# EAGLE design S284B (EAGLE 6.6.0)
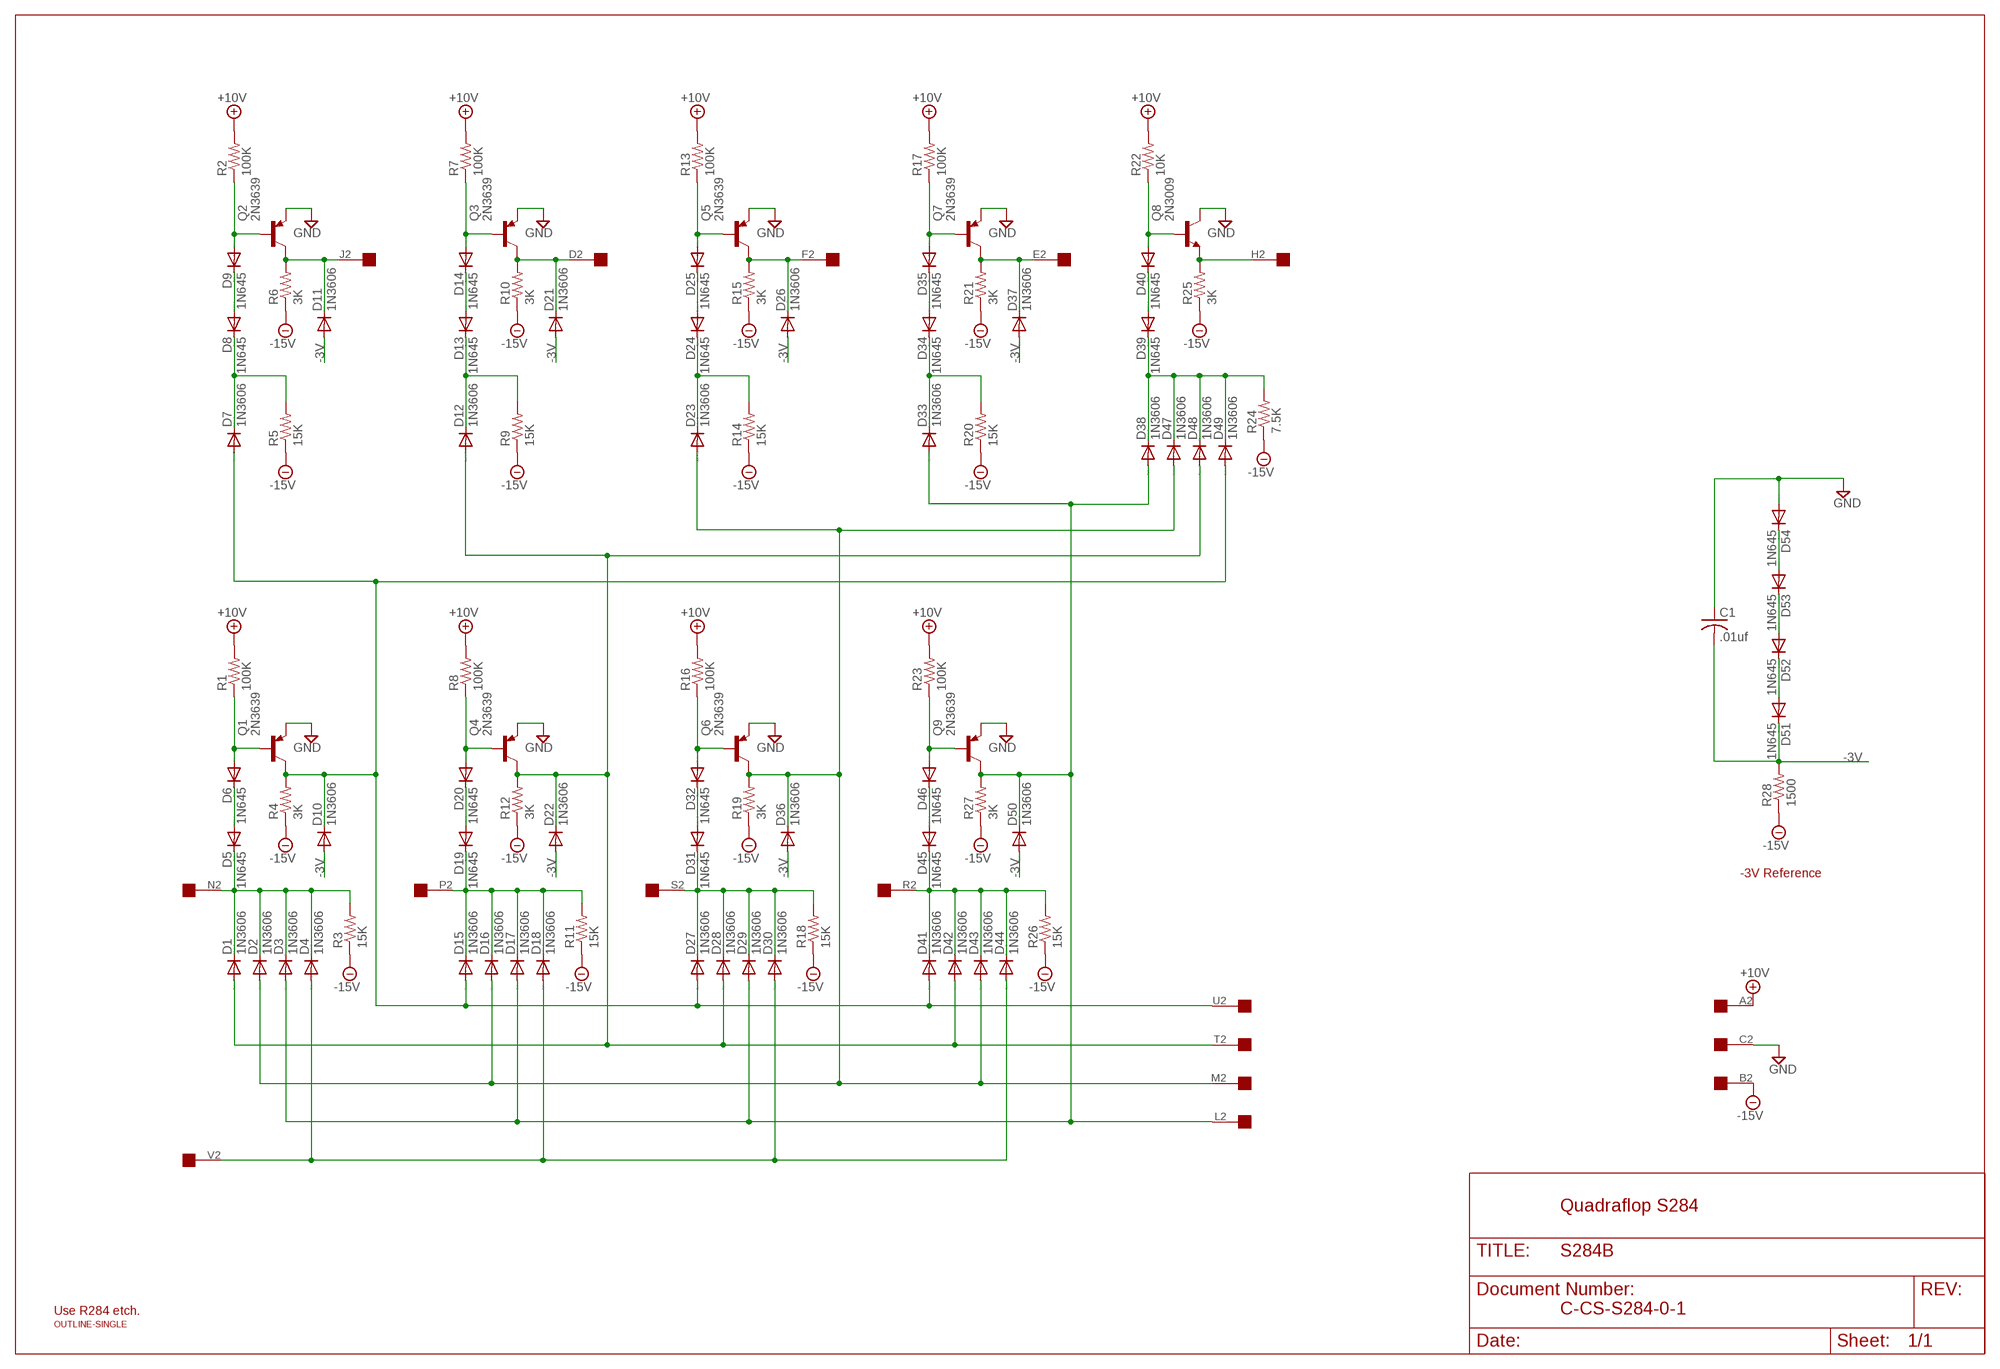
[diagram p0: schematic, sheet 1]

## Parts
C1  .01uf  C-US050-025X075  [C050-025X075]
D1  1N3606  1N4148DO35-10  [DO35-10]
D2  1N3606  1N4148DO35-10  [DO35-10]
D3  1N3606  1N4148DO35-10  [DO35-10]
D4  1N3606  1N4148DO35-10  [DO35-10]
D5  1N645  1N4148DO35-10  [DO35-10]
D6  1N645  1N4148DO35-10  [DO35-10]
D7  1N3606  1N4148DO35-10  [DO35-10]
D8  1N645  1N4148DO35-10  [DO35-10]
D9  1N645  1N4148DO35-10  [DO35-10]
D10  1N3606  1N4148DO35-10  [DO35-10]
D11  1N3606  1N4148DO35-10  [DO35-10]
D12  1N3606  1N4148DO35-10  [DO35-10]
D13  1N645  1N4148DO35-10  [DO35-10]
D14  1N645  1N4148DO35-10  [DO35-10]
D15  1N3606  1N4148DO35-10  [DO35-10]
D16  1N3606  1N4148DO35-10  [DO35-10]
D17  1N3606  1N4148DO35-10  [DO35-10]
D18  1N3606  1N4148DO35-10  [DO35-10]
D19  1N645  1N4148DO35-10  [DO35-10]
D20  1N645  1N4148DO35-10  [DO35-10]
D21  1N3606  1N4148DO35-10  [DO35-10]
D22  1N3606  1N4148DO35-10  [DO35-10]
D23  1N3606  1N4148DO35-10  [DO35-10]
D24  1N645  1N4148DO35-10  [DO35-10]
D25  1N645  1N4148DO35-10  [DO35-10]
D26  1N3606  1N4148DO35-10  [DO35-10]
D27  1N3606  1N4148DO35-10  [DO35-10]
D28  1N3606  1N4148DO35-10  [DO35-10]
D29  1N3606  1N4148DO35-10  [DO35-10]
D30  1N3606  1N4148DO35-10  [DO35-10]
D31  1N645  1N4148DO35-10  [DO35-10]
D32  1N645  1N4148DO35-10  [DO35-10]
D33  1N3606  1N4148DO35-10  [DO35-10]
D34  1N645  1N4148DO35-10  [DO35-10]
D35  1N645  1N4148DO35-10  [DO35-10]
D36  1N3606  1N4148DO35-10  [DO35-10]
D37  1N3606  1N4148DO35-10  [DO35-10]
D38  1N3606  1N4148DO35-10  [DO35-10]
D39  1N645  1N4148DO35-10  [DO35-10]
D40  1N645  1N4148DO35-10  [DO35-10]
D41  1N3606  1N4148DO35-10  [DO35-10]
D42  1N3606  1N4148DO35-10  [DO35-10]
D43  1N3606  1N4148DO35-10  [DO35-10]
D44  1N3606  1N4148DO35-10  [DO35-10]
D45  1N645  1N4148DO35-10  [DO35-10]
D46  1N645  1N4148DO35-10  [DO35-10]
D47  1N3606  1N4148DO35-10  [DO35-10]
D48  1N3606  1N4148DO35-10  [DO35-10]
D49  1N3606  1N4148DO35-10  [DO35-10]
D50  1N3606  1N4148DO35-10  [DO35-10]
D51  1N645  1N4148DO35-10  [DO35-10]
D52  1N645  1N4148DO35-10  [DO35-10]
D53  1N645  1N4148DO35-10  [DO35-10]
D54  1N645  1N4148DO35-10  [DO35-10]
Q1  2N3639  2N3637  [TO39]
Q2  2N3639  2N3637  [TO39]
Q3  2N3639  2N3637  [TO39]
Q4  2N3639  2N3637  [TO39]
Q5  2N3639  2N3637  [TO39]
Q6  2N3639  2N3637  [TO39]
Q7  2N3639  2N3637  [TO39]
Q8  2N3009  2N2102  [TO5]
Q9  2N3639  2N3637  [TO39]
R1  100K  R-US_0207/10  [0207/10]
R2  100K  R-US_0207/10  [0207/10]
R3  15K  R-US_0207/10  [0207/10]
R4  3K  R-US_0207/10  [0207/10]
R5  15K  R-US_0207/10  [0207/10]
R6  3K  R-US_0207/10  [0207/10]
R7  100K  R-US_0207/10  [0207/10]
R8  100K  R-US_0207/10  [0207/10]
R9  15K  R-US_0207/10  [0207/10]
R10  3K  R-US_0207/10  [0207/10]
R11  15K  R-US_0207/10  [0207/10]
R12  3K  R-US_0207/10  [0207/10]
R13  100K  R-US_0207/10  [0207/10]
R14  15K  R-US_0207/10  [0207/10]
R15  3K  R-US_0207/10  [0207/10]
R16  100K  R-US_0207/10  [0207/10]
R17  100K  R-US_0207/10  [0207/10]
R18  15K  R-US_0207/10  [0207/10]
R19  3K  R-US_0207/10  [0207/10]
R20  15K  R-US_0207/10  [0207/10]
R21  3K  R-US_0207/10  [0207/10]
R22  10K  R-US_0207/10  [0207/10]
R23  100K  R-US_0207/10  [0207/10]
R24  7.5K  R-US_0207/10  [0207/10]
R25  3K  R-US_0207/10  [0207/10]
R26  15K  R-US_0207/10  [0207/10]
R27  3K  R-US_0207/10  [0207/10]
R28  1500  R-US_0207/10  [0207/10]
U$1  OUTLINE-SINGLE  [SINGLE]
U$2  EDGE-1  [EDGE-CON1]

## Nets
+10V [Power]: R1.2 R2.2 R7.2 R8.2 R13.2 R16.2 R17.2 R22.2 R23.2 U$2.A2
-0.8V [Power]: D53.A D54.C
-3V [Power]: C1.2 D10.A D11.A D21.A D22.A D26.A D36.A D37.A D50.A D51.C R28.2
-15V [Power]: R3.1 R4.1 R5.1 R6.1 R9.1 R10.1 R11.1 R12.1 R14.1 R15.1 R18.1 R19.1 R20.1 R21.1 R24.1 R25.1 R26.1 R27.1 R28.1 U$2.B2
GND [Power]: C1.1 D54.A Q1.1(E) Q2.1(E) Q3.1(E) Q4.1(E) Q5.1(E) Q6.1(E) Q7.1(E) Q8.3(C) Q9.1(E) U$2.C2
L: D3.A D17.A D29.A D33.A D38.A D50.C Q9.3(C) R27.2 U$2.L2
M: D2.A D16.A D23.A D36.C D43.A D47.A Q6.3(C) R19.2 U$2.M2
N: D1.C D2.C D3.C D4.C D5.C R3.2 U$2.N2
N$2: D20.A Q4.2(B) R8.1
N$3: D19.A D20.C
N$4: D7.A D10.C D15.A D27.A D41.A D49.A Q1.3(C) R4.2 U$2.U2
N$5: D7.C D8.C R5.2
N$6: D1.A D12.A D22.C D28.A D42.A D48.A Q4.3(C) R12.2 U$2.T2
N$7: D12.C D13.C R9.2
N$8: D13.A D14.C
N$9: D8.A D9.C
N$12: D21.C Q3.3(C) R10.2 U$2.D2
N$13: D52.A D53.C
N$14: D11.C Q2.3(C) R6.2 U$2.J2
N$15: D14.A Q3.2(B) R7.1
N$16: D51.A D52.C
N$17: D27.C D28.C D29.C D30.C D31.C R18.2 U$2.S2
N$19: D32.A Q6.2(B) R16.1
N$20: D4.A D18.A D30.A D44.A U$2.V2
N$21: D31.A D32.C
N$22: D9.A Q2.2(B) R2.1
N$23: D38.C D39.C D47.C D48.C D49.C R24.2
N$24: D23.C D24.C R14.2
N$25: D24.A D25.C
N$26: D26.C Q5.3(C) R15.2 U$2.F2
N$28: D25.A Q5.2(B) R13.1
N$29: D41.C D42.C D43.C D44.C D45.C R26.2 U$2.R2
N$30: D6.A Q1.2(B) R1.1
N$31: D46.A Q9.2(B) R23.1
N$32: D5.A D6.C
N$33: D45.A D46.C
N$34: D40.A Q8.2(B) R22.1
N$35: D33.C D34.C R20.2
N$36: D34.A D35.C
N$37: D37.C Q7.3(C) R21.2 U$2.E2
N$38: D35.A Q7.2(B) R17.1
N$39: D39.A D40.C
N$40: Q8.1(E) R25.2 U$2.H2
P: D15.C D16.C D17.C D18.C D19.C R11.2 U$2.P2
Unconnected: U$2.K2

## Notes on the sheet
- -3V Reference
- Quadraflop S284
- Use R284 etch. | C-CS-S284-0-1

## Library data of the parts
C1 = rcl:C-US: CAPACITOR, American symbol
D1-D54 = diode:1N4148: DIODE high speed (Philips)
Q1-Q7 Q9 = transistor-pnp:2N3637*: PNP Transistror
Q8 = transistor:2N2102: NPN TRANSISTOR
R1-R28 = rcl:R-US_: RESISTOR, American symbol
U$1 = dec-con:OUTLINE-*: Board outlines for DEC boards.
U$2 = dec-con:EDGE-1: Single-Sided DEC Edge Connector -- (side 2)

## Net classes
1 Power: width 0.813 mm

## Board
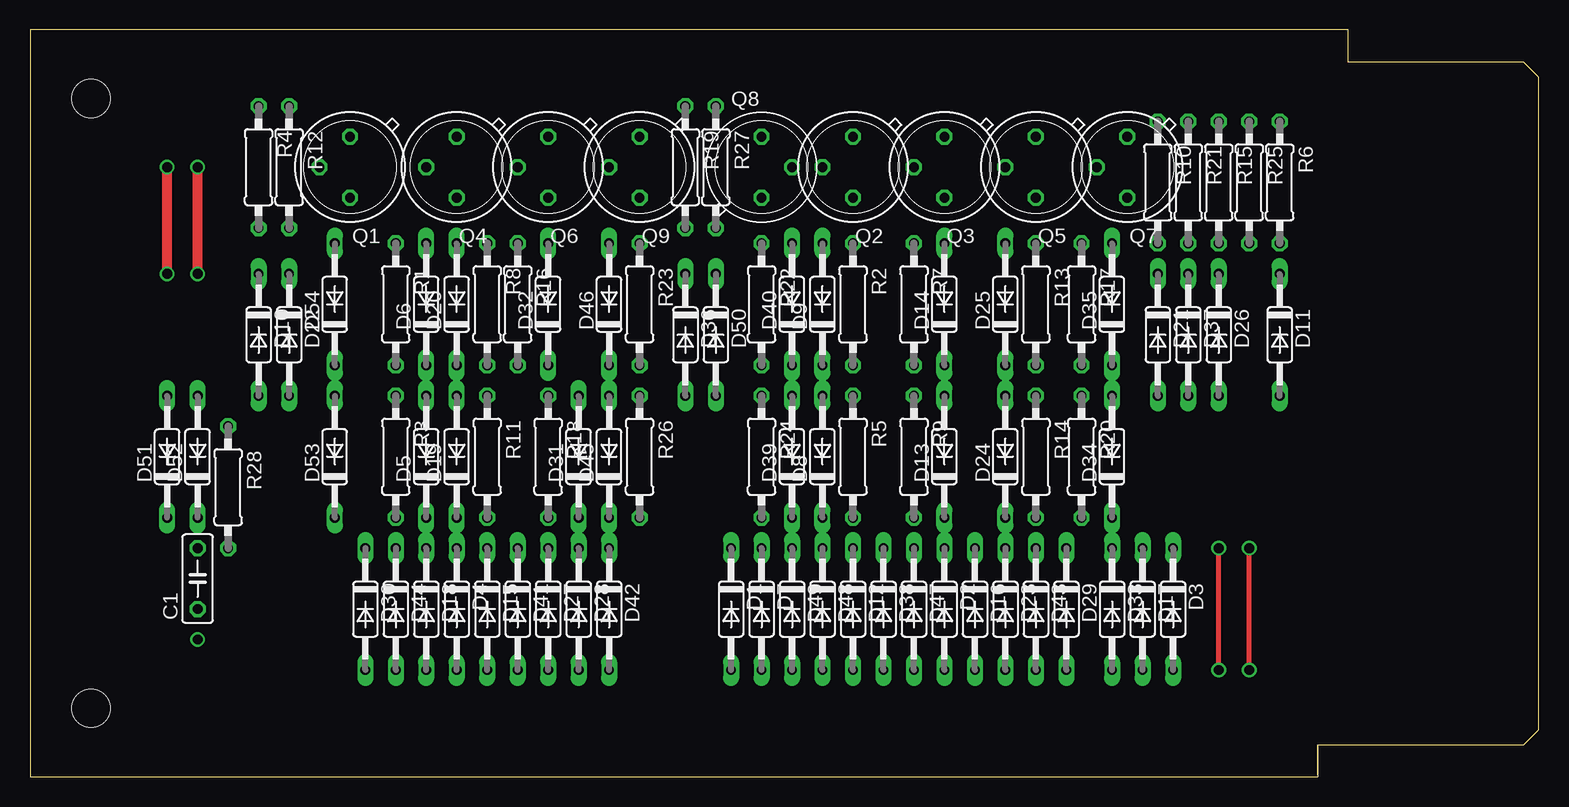
[diagram p1: board, top side]
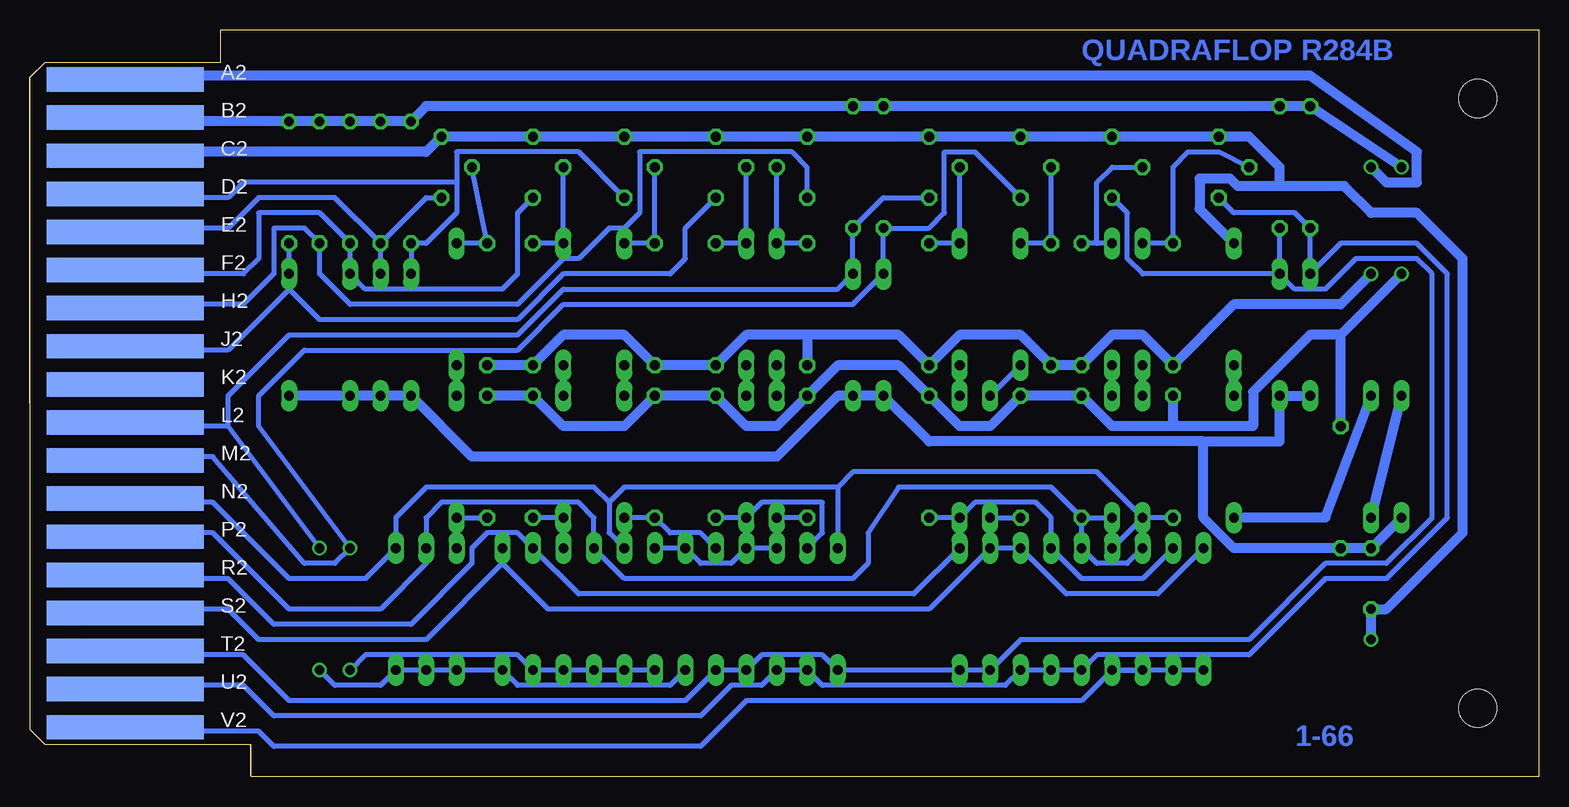
[diagram p2: board, bottom side, seen from below]

Size 125.73 x 62.23 mm. Coordinates in mm from the lower left corner, seen from the top.
Copper layers (1+16): Top 0.035mm / dielectric 1.5mm / Bottom 0.035mm
Design rules "16mils": minimum track width 16mil, minimum drill 32mil, track to track 15mil, track to pad 10mil, pad to pad 10mil, via to via 10mil, smd to smd 10mil, copper to edge 13mil, drill to drill 10mil, minimum pad ring 10mil, minimum via ring 8mil, stop-mask expansion 0mil, vias tented up to drill 0mil, thermal gap 10mil

### Footprints (pad centres in the part's own frame; a part is rotated, then mirrored left to right if it is on the bottom)
C050-025X075 = drill 0.813 octagon: 1 -2.54,0; 2 2.54,0
DO35-10 = drill 0.813 long: A 5.08,0; C -5.08,0
TO39 = drill 0.813 octagon: 1 0,-2.54; 2 2.54,0; 3 0,2.54
TO5 = drill 0.813 octagon: 1 0,-2.54; 2 2.54,0; 3 0,2.54
0207/10 = drill 0.813 octagon: 1 -5.08,0; 2 5.08,0
SINGLE = hole 3.175: 120.65,56.515; 120.65,5.715
EDGE-CON1 = smd 13.106 x 2.032 bottom: A2 7.938,4.128; B2 7.938,7.303; C2 7.938,10.477; D2 7.938,13.652; E2 7.938,16.828; F2 7.938,20.003; H2 7.938,23.177; J2 7.938,26.352; K2 7.938,29.527; L2 7.938,32.703; M2 7.938,35.877; N2 7.938,39.053; P2 7.938,42.227; R2 7.938,45.403; S2 7.938,48.578; T2 7.938,51.752; U2 7.938,54.928; V2 7.938,58.102

### Placement (x,y rotation side)
C1  13.97,16.51 90 top
D1  58.42,13.97 270 top
D2  76.2,13.97 270 top
D3  95.25,13.97 270 top
D4  35.56,13.97 270 top
D5  33.02,26.67 90 top
D6  33.02,39.37 90 top
D7  60.96,13.97 270 top
D8  66.04,26.67 90 top
D9  66.04,39.37 90 top
D10  19.05,36.83 270 top
D11  104.14,36.83 270 top
D12  68.58,13.97 270 top
D13  76.2,26.67 90 top
D14  76.2,39.37 90 top
D15  38.1,13.97 270 top
D16  78.74,13.97 270 top
D17  92.71,13.97 270 top
D18  33.02,13.97 270 top
D19  35.56,26.67 90 top
D20  35.56,39.37 90 top
D21  93.98,36.83 270 top
D22  21.59,36.83 270 top
D23  81.28,13.97 270 top
D24  81.28,26.67 90 top
D25  81.28,39.37 90 top
D26  99.06,36.83 270 top
D27  43.18,13.97 270 top
D28  45.72,13.97 270 top
D29  86.36,13.97 270 top
D30  27.94,13.97 270 top
D31  45.72,26.67 90 top
D32  43.18,39.37 90 top
D33  90.17,13.97 270 top
D34  90.17,26.67 90 top
D35  90.17,39.37 90 top
D36  54.61,36.83 270 top
D37  96.52,36.83 270 top
D38  71.12,13.97 270 top
D39  63.5,26.67 90 top
D40  63.5,39.37 90 top
D41  40.64,13.97 270 top
D42  48.26,13.97 270 top
D43  83.82,13.97 270 top
D44  30.48,13.97 270 top
D45  48.26,26.67 90 top
D46  48.26,39.37 90 top
D47  73.66,13.97 270 top
D48  66.04,13.97 270 top
D49  63.5,13.97 270 top
D50  57.15,36.83 270 top
D51  11.43,26.67 90 top
D52  13.97,26.67 90 top
D53  25.4,26.67 90 top
D54  25.4,39.37 90 top
Q1  26.67,50.8 180 top
Q2  68.58,50.8 180 top
Q3  76.2,50.8 180 top
Q4  35.56,50.8 180 top
Q5  83.82,50.8 180 top
Q6  43.18,50.8 180 top
Q7  91.44,50.8 180 top
Q8  60.96,50.8 0 top
Q9  50.8,50.8 180 top
R1  30.48,39.37 270 top
R2  68.58,39.37 270 top
R3  30.48,26.67 270 top
R4  19.05,50.8 270 top
R5  68.58,26.67 270 top
R6  104.14,49.53 270 top
R7  73.66,39.37 270 top
R8  38.1,39.37 270 top
R9  73.66,26.67 270 top
R10  93.98,49.53 270 top
R11  38.1,26.67 270 top
R12  21.59,50.8 270 top
R13  83.82,39.37 270 top
R14  83.82,26.67 270 top
R15  99.06,49.53 270 top
R16  40.64,39.37 270 top
R17  87.63,39.37 270 top
R18  43.18,26.67 270 top
R19  54.61,50.8 270 top
R20  87.63,26.67 270 top
R21  96.52,49.53 270 top
R22  60.96,39.37 270 top
R23  50.8,39.37 270 top
R24  60.96,26.67 270 top
R25  101.6,49.53 270 top
R26  50.8,26.67 270 top
R27  57.15,50.8 270 top
R28  16.51,24.13 270 top
U$1  125.73,62.23 180 top
U$2  125.73,62.23 180 top

### Tracks (layer width: path | path; a pad name or v marks a point on that pad's centre or on a via)
+10V  (via drill 0.81)
  Top 0.813: v13.97,41.91 v13.97,50.8
  Bottom 0.813: R17.2 R13.2 81.28,36.83 76.2,36.83 R7.2 R2.2 66.04,36.83 60.96,36.83 | U$2.A2 117.22,58.04 116.84,58.42 19.05,58.42 10.16,52.07 10.16,49.53 12.7,49.53 v13.97,50.8 | 60.96,36.83 R22.2 | 60.96,36.83 53.34,36.83 R23.2 48.26,36.83 43.18,36.83 R16.2 R8.2 35.56,36.83 33.02,36.83 R1.2 25.4,39.37 16.51,39.37 v13.97,41.91
-0.8V
  Bottom 0.813: D53.A D54.C
-3V
  Bottom 0.813: 27.94,27.94 21.59,27.94 D22.A D10.A | 27.94,27.94 50.8,27.94 D36.A D50.A 58.42,31.75 63.5,26.67 88.9,26.67 D21.A D37.A D26.A D11.A | D51.C C1.2 R28.2 25.4,19.05 27.94,21.59 27.94,27.94
-15V  (via drill 0.81)
  Top 0.813: v11.43,41.91 v11.43,50.8
  Bottom 0.813: U$2.B2 117.13,54.9 116.84,54.61 R6.1 R25.1 R15.1 R21.1 R10.1 92.71,55.88 R27.1 R19.1 R12.1 R4.1 v11.43,50.8 | R20.1 R14.1 81.28,29.21 76.2,29.21 R9.1 R5.1 66.04,29.21 63.5,29.21 R24.1 58.42,34.29 53.34,34.29 R26.1 48.26,29.21 45.72,29.21 R18.1 R11.1 35.56,29.21 30.48,29.21 | 30.48,29.21 R3.1 | 30.48,29.21 23.81,29.21 23.81,32.07 19.05,36.83 16.51,36.83 | 16.51,36.83 v11.43,41.91 | R28.1 16.51,36.83
GND  (via drill 0.81)
  Bottom 0.813: U$2.C2 117.17,51.74 116.84,52.07 92.71,52.07 Q7.1 Q5.1 Q3.1 Q2.1 Q8.3 Q9.1 Q6.1 Q4.1 Q1.1 24.13,53.34 21.59,50.8 21.59,49.21 | D54.A 28.26,47.31 28.26,49.85 25.72,49.85 25.08,49.21 21.59,49.21 | 21.59,49.21 16.19,49.21 13.97,46.99 10.16,46.99 6.35,43.18 6.35,20.32 12.7,13.97 C1.1 v13.97,11.43
L  (via drill 0.81)
  Top 0.406: v101.6,8.89 v101.6,19.05
  Bottom 0.406: v101.6,8.89 100.33,7.62 96.52,7.62 D3.A D17.A D33.A D29.A 85.09,7.62 72.39,7.62 D38.A | U$2.L2 117.17,29.54 116.84,29.21 109.22,29.21 | v101.6,19.05 109.22,29.21 | 109.22,29.21 109.22,31.75 104.14,36.83 85.09,36.83 81.28,40.64 58.42,40.64 D50.C R27.2 54.61,48.26 Q9.3
M  (via drill 0.81)
  Top 0.406: v99.06,8.89 v99.06,19.05
  Bottom 0.406: U$2.M2 117.17,26.34 116.84,26.67 110.49,26.67 102.87,17.78 100.33,17.78 v99.06,19.05 106.68,29.21 106.68,31.75 102.87,35.56 85.09,35.56 81.28,39.37 57.15,39.37 D36.C R19.2 50.8,45.72 49.53,46.99 49.53,52.07 46.99,52.07 Q6.3 | v99.06,8.89 97.79,10.16 85.09,10.16 D43.A D23.A D16.A D2.A D47.A
N
  Bottom 0.406: U$2.N2 117.17,23.19 116.84,22.86 110.49,22.86 104.14,16.51 97.79,16.51 D3.C 95.25,21.59 92.71,24.13 78.74,24.13 77.47,22.86 | D2.C 77.47,20.32 77.47,22.86 | 77.47,22.86 76.2,24.13 58.42,24.13 | R3.2 D5.C | D5.C 36.83,25.4 57.15,25.4 58.42,24.13 | 58.42,24.13 D1.C | D5.C D4.C
N$2
  Bottom 0.406: D20.A 36.83,44.45 | Q4.2 35.56,50.8 36.83,49.53 36.83,44.45 | 36.83,44.45 R8.1
N$3
  Bottom 0.406: D19.A D20.C
N$4
  Bottom 0.406: U$2.U2 114.66,7.26 114.3,7.62 107.95,7.62 105.41,5.08 69.85,5.08 67.31,7.62 64.77,7.62 D49.A D7.A 59.69,7.62 44.45,7.62 D27.A D41.A D15.A 36.83,10.16 24.13,10.16 17.78,16.51 12.7,16.51 7.62,21.59 7.62,41.91 10.16,44.45 16.51,44.45 D10.C R4.2 20.32,46.99 25.4,46.99 Q1.3
N$5
  Bottom 0.406: R5.2 D8.C 64.77,22.86 59.69,22.86 59.69,20.32 D7.C
N$6
  Bottom 0.406: U$2.T2 117.17,10.49 116.84,10.16 107.95,10.16 104.14,6.35 71.12,6.35 D12.A D48.A 64.77,10.16 59.69,10.16 D1.A D42.A D28.A 43.18,11.43 24.13,11.43 17.78,17.78 12.7,17.78 8.89,21.59 8.89,41.91 10.16,43.18 15.24,43.18 17.78,40.64 20.32,40.64 D22.C | D22.C R12.2 | Q4.3 34.29,46.99 34.29,43.18 33.02,41.91 D22.C
N$7
  Bottom 0.406: D12.C 69.85,20.32 72.39,20.32 R9.2 D13.C
N$8
  Bottom 0.406: D13.A D14.C
N$9
  Bottom 0.406: D8.A D9.C
N$12
  Bottom 0.406: U$2.D2 117.14,48.56 116.84,48.26 109.22,48.26 107.95,49.53 90.17,49.53 | 90.17,49.53 90.17,46.99 92.71,44.45 R10.2 D21.C | 90.17,49.53 90.17,52.07 80.01,52.07 Q3.3
N$13
  Bottom 0.813: D53.C 17.78,21.59 D52.A
N$14
  Bottom 0.406: U$2.J2 117.17,35.89 116.84,35.56 109.22,35.56 104.14,40.64 | R6.2 D11.C 104.14,40.64 | 104.14,40.64 101.6,38.1 85.09,38.1 81.28,41.91 72.39,41.91 71.12,43.18 71.12,45.72 Q2.3
N$15
  Bottom 0.406: D14.A R7.1 Q3.2
N$16
  Bottom 0.813: D52.C D51.A
N$17
  Bottom 0.406: U$2.S2 117.14,13.66 116.84,13.97 109.22,13.97 106.68,11.43 92.71,11.43 86.36,17.78 | D28.C D27.C 39.37,15.24 31.75,15.24 D30.C | D28.C 50.8,13.97 82.55,13.97 86.36,17.78 | 86.36,17.78 D29.C | R18.2 D31.C D28.C
N$19
  Bottom 0.406: D32.A R16.1 Q6.2
N$20
  Bottom 0.406: U$2.V2 117.16,4.13 116.84,3.81 106.68,3.81 105.41,2.54 69.85,2.54 66.04,6.35 38.1,6.35 D4.A | D4.A D18.A D4.A | D30.A D44.A D4.A
N$21
  Bottom 0.406: D31.A D32.C
N$22
  Bottom 0.406: R2.1 D9.A Q2.2
N$23
  Bottom 0.406: D47.C D38.C 69.85,17.78 67.31,17.78 D48.C D49.C D39.C R24.2
N$24
  Bottom 0.406: R14.2 D24.C D23.C
N$25
  Bottom 0.406: D24.A D25.C
N$26
  Bottom 0.406: U$2.F2 117.12,42.19 116.84,41.91 107.95,41.91 106.68,43.18 106.68,46.99 101.6,46.99 R15.2 D26.C 97.79,40.64 86.36,40.64 85.09,41.91 85.09,46.99 Q5.3
N$28
  Bottom 0.406: Q5.2 D25.A R13.1
N$29
  Bottom 0.406: U$2.R2 117.17,16.84 116.84,16.51 109.22,16.51 105.41,12.7 93.98,12.7 88.9,17.78 88.9,19.05 87.63,20.32 85.09,20.32 D43.C 80.01,15.24 52.07,15.24 D42.C D45.C | D45.C R26.2 | D45.C 46.99,22.86 41.91,22.86 40.64,21.59 D41.C 38.1,16.51 33.02,16.51 D44.C
N$30
  Bottom 0.406: D6.A R1.1 30.48,50.8 29.21,52.07 26.67,52.07 Q1.2
N$31
  Bottom 0.406: R23.1 D46.A Q9.2
N$32
  Bottom 0.406: D5.A D6.C
N$33
  Bottom 0.406: D45.A D46.C
N$34
  Bottom 0.406: R22.1 D40.A Q8.2
N$35
  Bottom 0.406: R20.2 D34.C D33.C
N$36
  Bottom 0.406: D34.A D35.C
N$37
  Bottom 0.406: R21.2 100.33,48.26 106.68,48.26 109.22,45.72 116.84,45.72 117.17,45.39 U$2.E2 | D37.C R21.2 | Q7.3 92.71,48.26 R21.2
N$38
  Bottom 0.406: Q7.2 R17.1 D35.A
N$39
  Bottom 0.406: D39.A D40.C
N$40
  Bottom 0.406: U$2.H2 117.17,39.04 116.84,39.37 107.95,39.37 105.41,41.91 105.41,45.72 102.87,45.72 R25.2 101.6,41.91 99.06,39.37 85.09,39.37 81.28,43.18 80.01,43.18 77.47,45.72 76.2,45.72 74.93,46.99 74.93,52.07 62.23,52.07 60.96,50.8 Q8.1
P
  Bottom 0.406: U$2.P2 117.17,19.99 116.84,20.32 110.49,20.32 104.14,13.97 96.52,13.97 92.71,17.78 D17.C 92.71,21.59 91.44,22.86 80.01,22.86 78.74,21.59 D16.C 76.2,16.51 57.15,16.51 55.88,17.78 55.88,20.32 53.34,24.13 40.64,24.13 R11.2 | R11.2 D19.C | D18.C 34.29,17.78 36.83,17.78 D15.C R11.2

### Text on the board
Bottom: QUADRAFLOP R284B | 1-66